# Altium project Magneto.PrjPCB (part 1 of 5)
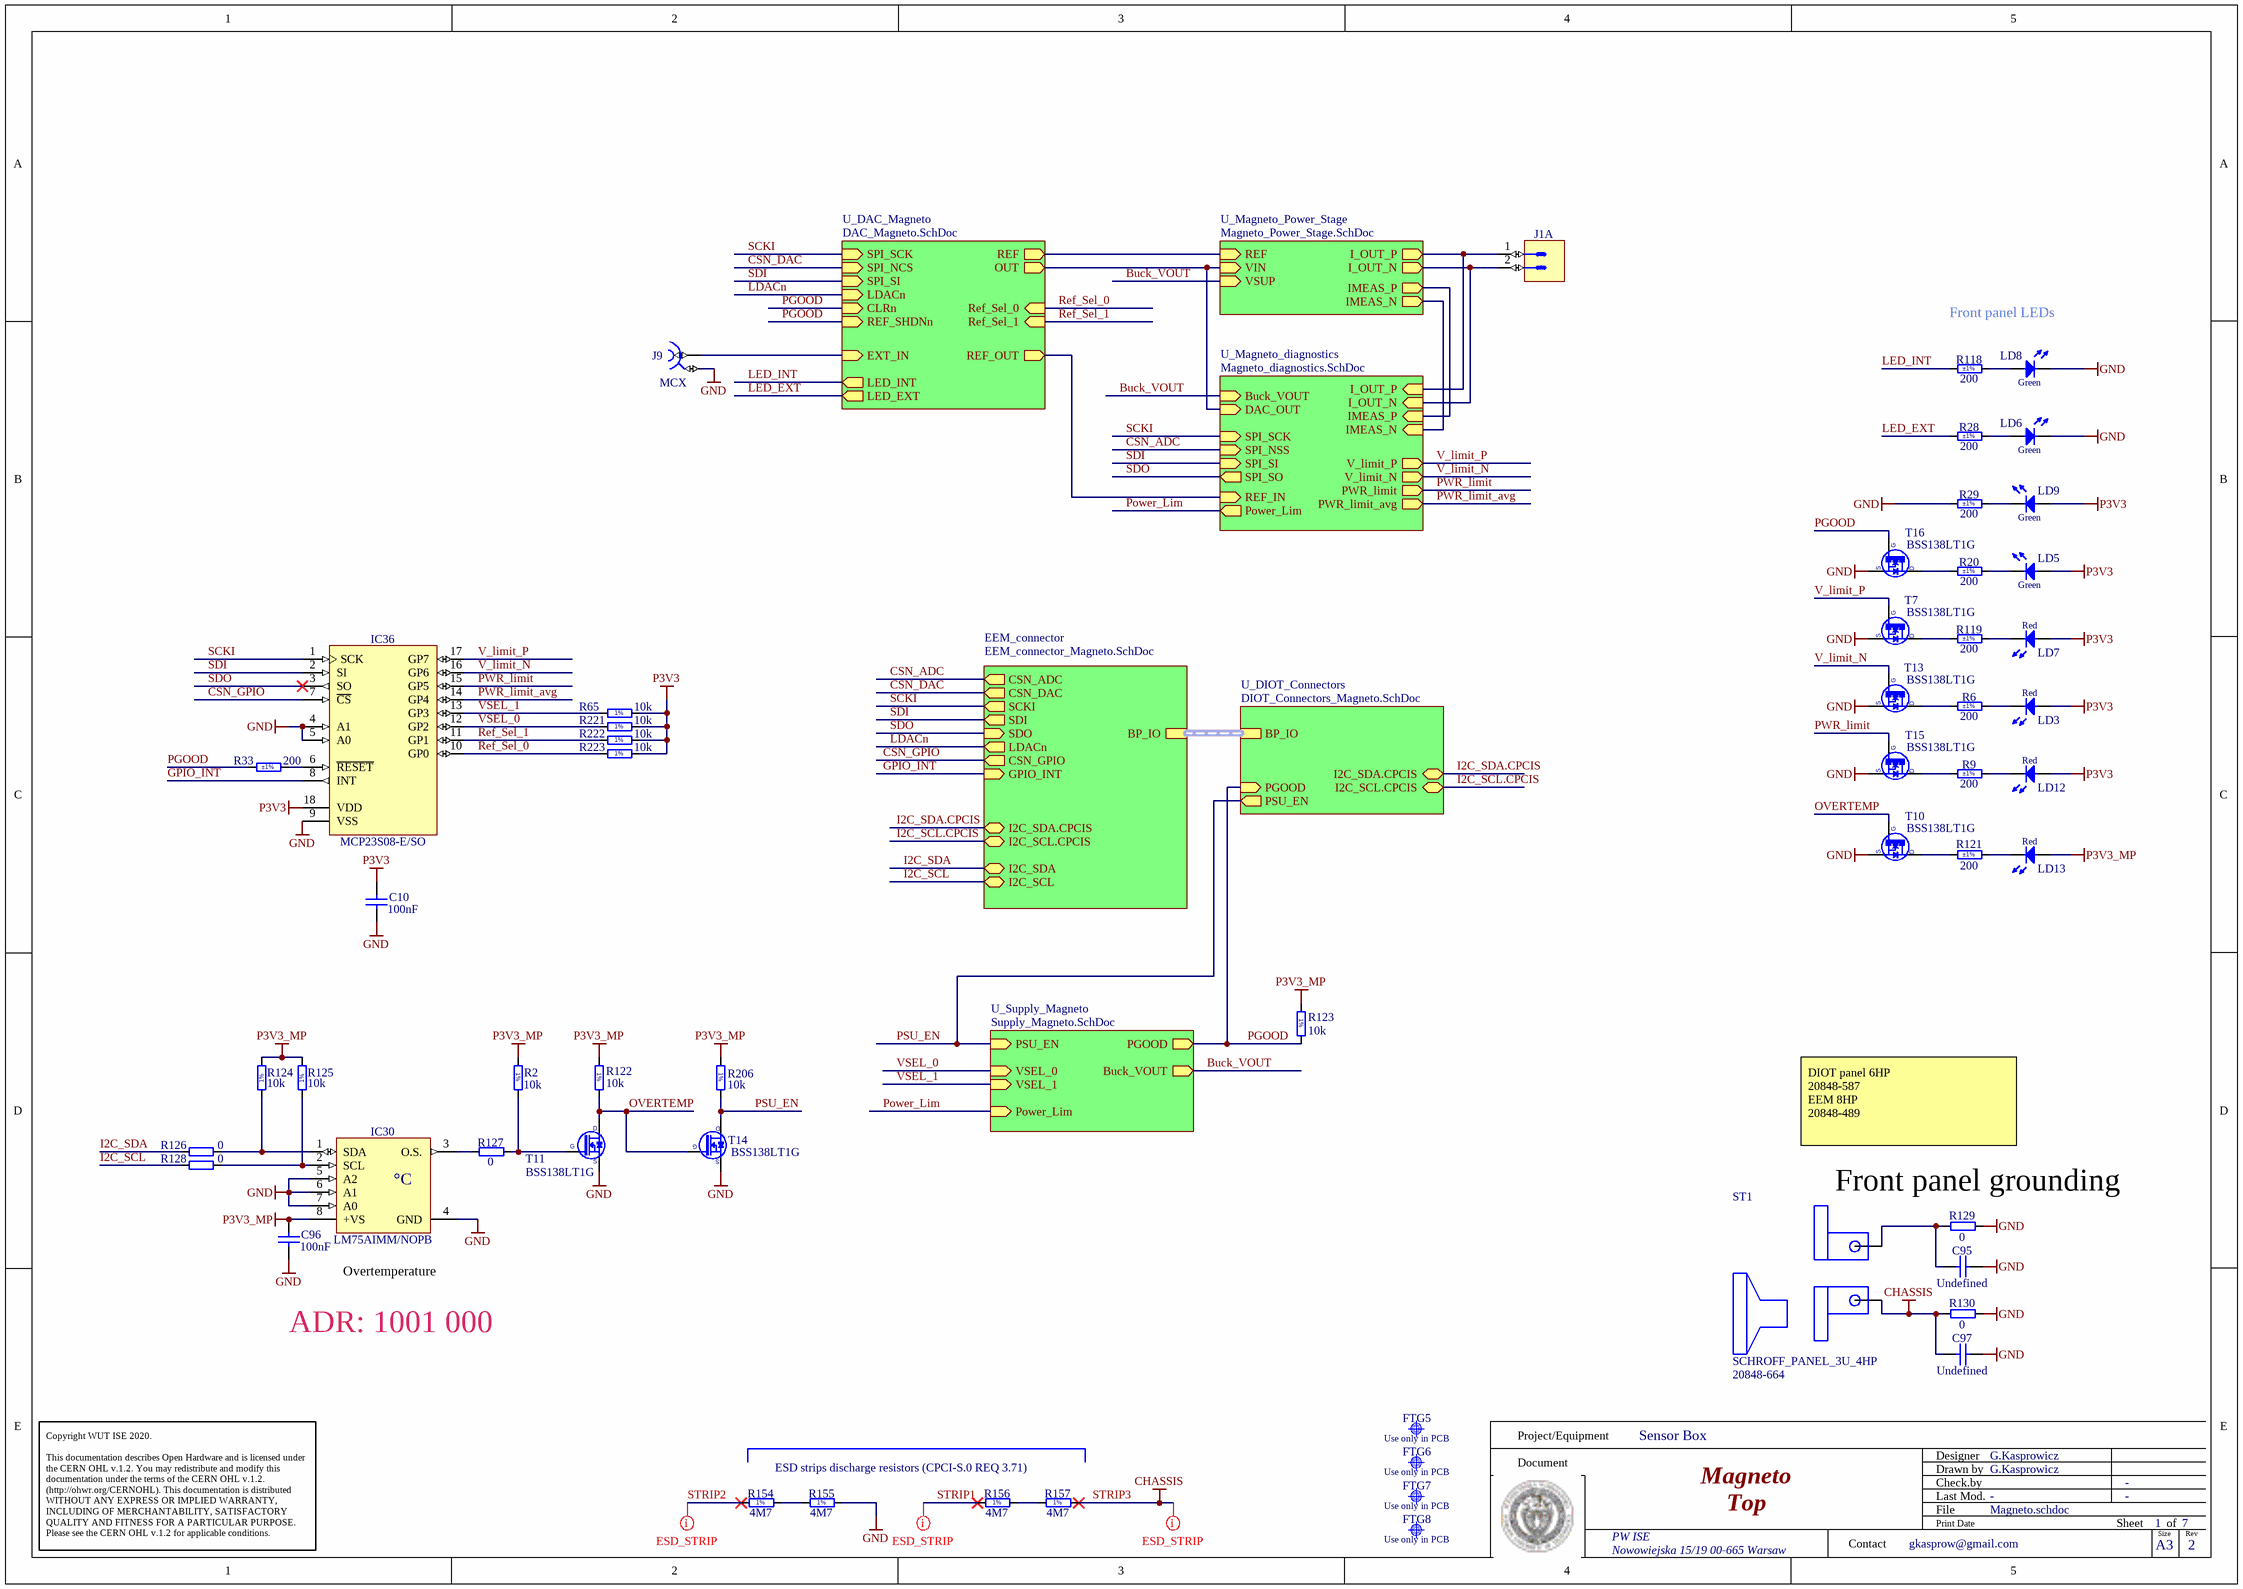
[diagram p0: Magneto.schdoc]
8 sheets, 547 parts. Net scope: hierarchical (ports join the sheet entries above them; power ports are global).
Board file: Magneto.PCBDOC
Sheets:
  Magneto.schdoc
    EEM_connector = EEM_connector_Magneto.SchDoc
    U_DIOT_Connectors = DIOT_Connectors_Magneto.SchDoc
    U_DAC_Magneto = DAC_Magneto.SchDoc
    U_Magneto_Power_Stage = Magneto_Power_Stage.SchDoc
    U_Supply_Magneto = Supply_Magneto.SchDoc
      U_Supply_BuckVout = Supply_BuckVout.SchDoc
    U_Magneto_diagnostics = Magneto_diagnostics.SchDoc

## Sheet Magneto.schdoc: Magneto
size 420 x 297 mm; EDA_Number: ARTIQ; Projet: HVPSU_ISOL; Author: G.Kasprowicz; CompanyName: WUT ISE; DrawnBy: G.Kasprowicz; Organization: WUT ISE; Address1: PW ISE; Address2: Nowowiejska 15/19 00-665 Warsaw; Address3: gkasprow@gmail.com; DocumentNumber: 1; Revision: 2; SheetNumber: 1; SheetTotal: 7; ModifiedBy: -; CheckedDate: -; Title2: Top; DivGrp: WUT ISE; Designer: G.Kasprowicz; ModifiedDate: -; ProjectName: Sensor Box

### Parts
C10  100nF  [CAPC1005X55N]
C95  Undefined  [CAPC2012X135N]
C96  100nF  [CAPC1005X55N]
C97  Undefined  [CAPC2012X135N]
FTG5  Use only in PCB  [FIDUCIAL_TOP_C100-200]  (no BOM)
FTG6  Use only in PCB  [FIDUCIAL_TOP_S100-200]  (no BOM)
FTG7  Use only in PCB  [FIDUCIAL_TOP_S100-200]  (no BOM)
FTG8  Use only in PCB  [FIDUCIAL_TOP_S100-200]  (no BOM)
IC30  LM75AIMM/NOPB  [SOP65P490X109-8N]
IC36  MCP23S08-E/SO  [SOIC127P1030X265-18N]
J1  (no value)  [PHOENIX_1817615]  (part A of 2)
J9  MCX  [AMPHENOL_919-383J-51A]
LD3  Red  [LED_DIALIGHT_555-200]
LD5  Green  [LED_DIALIGHT_555-230]
LD6  Green  [LED_DIALIGHT_555-230]
LD7  Red  [LED_DIALIGHT_555-200]
LD8  Green  [LED_DIALIGHT_555-230]
LD9  Green  [LED_DIALIGHT_555-230]
LD12  Red  [LED_DIALIGHT_555-200]
LD13  Red  [LED_DIALIGHT_555-200]
R2  10k  [RESC1005X40N]
R6  200  Tolerance: ±1%  [RESC1608X55N]
R9  200  Tolerance: ±1%  [RESC1608X55N]
R20  200  Tolerance: ±1%  [RESC1608X55N]
R28  200  Tolerance: ±1%  [RESC1608X55N]
R29  200  Tolerance: ±1%  [RESC1608X55N]
R33  200  Tolerance: ±1%  [RESC1608X55N]
R65  10k  [RESC1005X40N]
R118  200  Tolerance: ±1%  [RESC1608X55N]
R119  200  Tolerance: ±1%  [RESC1608X55N]
R121  200  Tolerance: ±1%  [RESC1608X55N]
R122  10k  [RESC1005X40N]
R123  10k  [RESC1005X40N]
R124  10k  [RESC1005X40N]
R125  10k  [RESC1005X40N]
R126  0  [RESC1005X40N]
R127  0  [RESC1005X40N]
R128  0  [RESC1005X40N]
R129  0  [RESC2012X60N]
R130  0  [RESC2012X60N]
R154  4M7  [RESC2113X55N]
R155  4M7  [RESC2113X55N]
R156  4M7  [RESC2113X55N]
R157  4M7  [RESC2113X55N]
R206  10k  [RESC1005X40N]
R221  10k  [RESC1005X40N]
R222  10k  [RESC1005X40N]
R223  10k  [RESC1005X40N]
ST1  SCHROFF_PANEL_3U_4HP  Manufacturer Part Number 2: 20848-664  [SCHROFF_PANEL_3HP_4U]
T7  BSS138LT1G  [SOT95P240X110-3N]
T10  BSS138LT1G  [SOT95P240X110-3N]
T11  BSS138LT1G  [SOT95P240X110-3N]
T13  BSS138LT1G  [SOT95P240X110-3N]
T14  BSS138LT1G  [SOT95P240X110-3N]
T15  BSS138LT1G  [SOT95P240X110-3N]
T16  BSS138LT1G  [SOT95P240X110-3N]

### Sub-sheets
EEM_connector = EEM_connector_Magneto.SchDoc: BP_IO (harness BP_Conn), I2C_SDA.CPCIS (bidir), I2C_SCL.CPCIS (bidir), I2C_SDA (bidir), I2C_SCL (bidir), CSN_DAC (out), SCKI (out), SDI (out), LDACn (out), SDO (in), CSN_ADC (out), CSN_GPIO (out), GPIO_INT (in)
U_DAC_Magneto = DAC_Magneto.SchDoc: OUT (out), SPI_SCK (in), SPI_NCS (in), SPI_SI (in), CLRn (in), LDACn (in), REF_SHDNn (in), Ref_Sel_0 (in), Ref_Sel_1 (in), REF (out), EXT_IN (in), LED_INT (out), LED_EXT (out), REF_OUT (out)
U_DIOT_Connectors = DIOT_Connectors_Magneto.SchDoc: BP_IO (harness BP_Conn), I2C_SDA.CPCIS (bidir), I2C_SCL.CPCIS (bidir), PSU_EN (out), PGOOD (in)
U_Magneto_diagnostics = Magneto_diagnostics.SchDoc: Buck_VOUT (in), IMEAS_N (in), DAC_OUT (in), V_limit_P (out), V_limit_N (out), PWR_limit (out), SPI_SCK (in), SPI_NSS (in), SPI_SI (in), SPI_SO (out), I_OUT_P (in), I_OUT_N (in), IMEAS_P (in), REF_IN (in), Power_Lim (out), PWR_limit_avg (out)
U_Magneto_Power_Stage = Magneto_Power_Stage.SchDoc: REF (in), VIN (in), VSUP (in), I_OUT_P (out), I_OUT_N (out), IMEAS_P (out), IMEAS_N (out)
U_Supply_Magneto = Supply_Magneto.SchDoc: PSU_EN (in), PGOOD (out), VSEL_0 (in), VSEL_1 (in), Buck_VOUT (out), Power_Lim (in)

### Nets
CHASSIS: C97.1 R130.1 R157.2 ST1.0  [also labelled STRIP3]
GND: C10.1 C95.2 C96.1 C97.2 IC30.4(GND) IC30.5(A2) IC30.6(A1) IC30.7(A0) IC36.4(A1) IC36.5(A0) IC36.9(VSS) J9.2 LD6.1(C) LD8.1(C) R29.2 R129.2 R130.2 R155.2 T7.2(S) T10.2(S) T11.2(S) T13.2(S) T14.2(S) T15.2(S) T16.2(S)
P3V3: C10.2 IC36.18(VDD) LD3.2(A) LD5.2(A) LD7.2(A) LD9.2(A) LD12.2(A) R65.2 R221.2 R222.2 R223.2
P3V3_MP: C96.2 IC30.8(+VS) LD13.2(A) R2.1 R122.1 R123.1 R124.2 R125.2 R206.1
Buck_VOUT: sheet U_Magneto_Power_Stage/VSUP, sheet U_Supply_Magneto/Buck_VOUT, sheet U_Magneto_diagnostics/Buck_VOUT
CSN_ADC: sheet EEM_connector/CSN_ADC, sheet U_Magneto_diagnostics/SPI_NSS
CSN_DAC: sheet EEM_connector/CSN_DAC, sheet U_DAC_Magneto/SPI_NCS
CSN_GPIO: IC36.7(~{CS}) ; sheet EEM_connector/CSN_GPIO
DAC_OUT: sheet U_DAC_Magneto/OUT, sheet U_Magneto_Power_Stage/VIN, sheet U_Magneto_diagnostics/DAC_OUT
EXT_IN: J9.1 ; sheet U_DAC_Magneto/EXT_IN
GPIO_INT: IC36.8(INT) ; sheet EEM_connector/GPIO_INT
I2C_SCL: R128.1 ; sheet EEM_connector/I2C_SCL
I2C_SCL.CPCIS: sheet EEM_connector/I2C_SCL.CPCIS, sheet U_DIOT_Connectors/I2C_SCL.CPCIS
I2C_SDA: R126.1 ; sheet EEM_connector/I2C_SDA
I2C_SDA.CPCIS: sheet EEM_connector/I2C_SDA.CPCIS, sheet U_DIOT_Connectors/I2C_SDA.CPCIS
I_OUT_N: J1.2 ; sheet U_Magneto_Power_Stage/I_OUT_N, sheet U_Magneto_diagnostics/I_OUT_N
I_OUT_P: J1.1 ; sheet U_Magneto_Power_Stage/I_OUT_P, sheet U_Magneto_diagnostics/I_OUT_P
IMEAS_N: sheet U_Magneto_Power_Stage/IMEAS_N, sheet U_Magneto_diagnostics/IMEAS_N
IMEAS_P: sheet U_Magneto_Power_Stage/IMEAS_P, sheet U_Magneto_diagnostics/IMEAS_P
LDACn: sheet EEM_connector/LDACn, sheet U_DAC_Magneto/LDACn
LED_EXT: R28.1 ; sheet U_DAC_Magneto/LED_EXT
LED_INT: R118.1 ; sheet U_DAC_Magneto/LED_INT
OVERTEMP: R122.2 T10.1(G) T11.3(D) T14.1(G)
PGOOD: R33.1 R123.2 T16.1(G) ; sheet U_DIOT_Connectors/PGOOD, sheet U_DAC_Magneto/CLRn, sheet U_DAC_Magneto/REF_SHDNn, sheet U_Supply_Magneto/PGOOD
Power_Lim: sheet U_Supply_Magneto/Power_Lim, sheet U_Magneto_diagnostics/Power_Lim
PSU_EN: R206.2 T14.3(D) ; sheet U_DIOT_Connectors/PSU_EN, sheet U_Supply_Magneto/PSU_EN
PWR_limit: IC36.15(GP5) T15.1(G) ; sheet U_Magneto_diagnostics/PWR_limit
PWR_limit_avg: IC36.14(GP4) ; sheet U_Magneto_diagnostics/PWR_limit_avg
REF: sheet U_DAC_Magneto/REF, sheet U_Magneto_Power_Stage/REF
REF_IN: sheet U_DAC_Magneto/REF_OUT, sheet U_Magneto_diagnostics/REF_IN
Ref_Sel_0: IC36.10(GP0) R223.1 ; sheet U_DAC_Magneto/Ref_Sel_0
Ref_Sel_1: IC36.11(GP1) R222.1 ; sheet U_DAC_Magneto/Ref_Sel_1
SCKI: IC36.1(SCK) ; sheet EEM_connector/SCKI, sheet U_DAC_Magneto/SPI_SCK, sheet U_Magneto_diagnostics/SPI_SCK
SDI: IC36.2(SI) ; sheet EEM_connector/SDI, sheet U_DAC_Magneto/SPI_SI, sheet U_Magneto_diagnostics/SPI_SI
SDO: IC36.3(SO) ; sheet EEM_connector/SDO, sheet U_Magneto_diagnostics/SPI_SO
STRIP1: R156.1
STRIP2: R154.1
V_limit_N: IC36.16(GP6) T13.1(G) ; sheet U_Magneto_diagnostics/V_limit_N
V_limit_P: IC36.17(GP7) T7.1(G) ; sheet U_Magneto_diagnostics/V_limit_P
VSEL_0: IC36.12(GP2) R221.1 ; sheet U_Supply_Magneto/VSEL_0
VSEL_1: IC36.13(GP3) R65.1 ; sheet U_Supply_Magneto/VSEL_1
NetC95_1: C95.1 R129.1 ST1.1
NetIC30_1: IC30.1(SDA) R124.1 R126.2
NetIC30_2: IC30.2(SCL) R125.1 R128.2
NetIC30_3: IC30.3(O.S.) R127.1
NetIC36_6: IC36.6(~{RESET}) R33.2
NetLD3_1: LD3.1(C) R6.2
NetLD5_1: LD5.1(C) R20.1
NetLD6_2: LD6.2(A) R28.2
NetLD7_1: LD7.1(C) R119.2
NetLD8_2: LD8.2(A) R118.2
NetLD9_1: LD9.1(C) R29.1
NetLD12_1: LD12.1(C) R9.2
NetLD13_1: LD13.1(C) R121.2
NetR2_2: R2.2 R127.2 T11.1(G)
NetR6_1: R6.1 T13.3(D)
NetR9_1: R9.1 T15.3(D)
NetR20_2: R20.2 T16.3(D)
NetR119_1: R119.1 T7.3(D)
NetR121_1: R121.1 T10.3(D)
NetR154_2: R154.2 R155.1
NetR156_2: R156.2 R157.1

### Buses and harness runs
harness sheet EEM_connector/BP_IO = sheet U_DIOT_Connectors/BP_IO

### Layout directives
net class ESD_STRIP: CHASSIS, STRIP1, STRIP2

### Notes on the sheet
- Front panel LEDs
- DIOT panel 6HP
  20848-587
  EEM 8HP
  20848-489
- (near R129) Front panel grounding
- ADR: 1001 000
- Overtemperature
- ESD strips discharge resistors (CPCI-S.0 REQ 3.71)
- Project/Equipment
- Document
- Designer
- Drawn by
- Check.by
- Copyright WUT ISE 2020.
  This documentation describes Open Hardware and is licensed under the CERN OHL v.1.2. You may redistribute and modify this documentation under the terms of the CERN OHL v.1.2. (http://ohwr.org/CERNOHL). This documentation is distributed WITHOUT ANY EXPRESS OR IMPLIED WARRANTY, INCLUDING OF MERCHANTABILITY, SATISFACTORY QUALITY AND FITNESS FOR A PARTICULAR PURPOSE. Please see the CERN OHL v.1.2 for applicable conditions.
- Contact
- File
- Last Mod.
- Print Date
- Sheet
- Size
- A3
- of
- Rev
- (in symbol LM75AIMM/NOPB) °C
- (in symbol R0402_10K_1%_0.0625W_100PPM) 1%
- (in symbol R0805_4M7_1%_0.125W_100PPM_VISHAY_CRCW e3) 1%

### Library data of the parts
C10 C96 = CC0402_100NF_16V_10%_X5R: Non-polarised capacitor; Part Description: SMD Multilayer Chip Ceramic Capacitor; Manufacturer: GENERIC; Manufacturer1 Part Number: GRM155R61C104KA88D; Voltage: 16V; TC: X5R; Tolerance: ±10%; Part Number: CC0402_100NF_16V_10%_X5R; Component Kind: Standard; Component Type: Standard; Pin Count: 2; Value: 100nF; Status: None; Manufacturer Part Number: CC0402_100NF_16V_10%_X5R; Case: 0402; Mounted: Yes; Socket: No; SMD: Yes; Sense: No; Manufacturer1 Example: MURATA; Manufacturer1 ComponentHeight: 0.55mm; HelpURL: \\cern.ch\dfs\Applications\Altium\Datasheets\CC0402_X5R_MURATA_GRM.pdf; Author: CERN DEM JLC; CreateDate: 10.12.2013; LatestRevisionDate: 10.12.2013
C95 C97 = CC0805_NO-VALUE: Non-polarised capacitor; Part Description: Reserved Footprint For 0805(2012) Chip Ceramic Capacitor; Mounted: No; Part Number: CC0805_NO-VALUE; Component Kind: Standard; Component Type: Standard; Pin Count: 2; Value: Undefined; Status: None; Manufacturer: Undefined; Manufacturer Part Number: CC0805_NO-VALUE; Case: 0805; Socket: No; SMD: Yes; Sense: No; Manufacturer1 ComponentHeight: 1.35mm; HelpURL: Undefined; Author: CERN DEM JLC; CreateDate: 10.12.2008; LatestRevisionDate: 11.09.2013
FTG5 = FIDUCIAL_TARGET_C100-200: Fiducial Target; Part Description: Round Fiducial Target, Top Layer, 1.0mm, Top Solder 2.0mm, Keepout =2.0mm; Mounted: No; Part Number: FIDUCIAL_TARGET_C100-200; Component Type: Standard (No BOM); Pin Count: 1; Family: Fiducial; Socket: No; SMD: Yes; Sense: No; Status: None; ComponentHeight: 0mm; HelpURL: Undefined; Author: CERN DEM JLC; CreateDate: 09.02.2010; LatestRevisionDate: 04.04.2012; PackageDescription: Round Fiducial Target, Top Layer, 1.0mm, Top Solder 2.0mm, Keepout =2.0mm
FTG6-FTG8 = FIDUCIAL_TARGET_S100-200: Fiducial Target; Part Description: Square Fiducial Target, Top Layer, 1.0mm, Top Solder 2.0mm, Keepout =2.0mm; Mounted: No; Part Number: FIDUCIAL_TARGET_S100-200; Component Type: Standard (No BOM); Pin Count: 1; Family: Fiducial; Socket: No; SMD: Yes; Sense: No; Status: None; ComponentHeight: 0mm; HelpURL: Undefined; Author: CERN DEM JLC; CreateDate: 09.02.2010; LatestRevisionDate: 04.04.2012; PackageDescription: Square Fiducial Target, Top Layer, 1.0mm, Top Solder 2.0mm, Keepout =2.0mm
IC30 = LM75AIMM/NOPB: Digital Temperature Sensor and Thermal Watchdog with Two-Wire Interface; Manufacturer1: TEXAS INSTRUMENTS; jcIC31: -25° to +100°C ±2°C Digital Temperature Sensor and Thermal Watchdog with Two-Wire Interface; PressFit: No; Bonding: No; Part Number: LM75AIMM/NOPB; Component Kind: Standard; Component Type: Standard; Device: LM75AIMM/NOPB; PackageDescription: SOP, 0.65mm pitch; 8 pin,3.00mm W X 3.00mm L X 1.09mm H bodyI, PC Medium Density; Manufacturer1 Part Number: LM75AIMM/NOPB; Pin Count: 8; Case: SSOP8; Mounted: Yes; Socket: No; SMD: Yes; Sense: No; ComponentHeight: 1.09mm; HelpURL: \\cern.ch\dfs\Applications\Altium\Datasheets\LM75AIMM-NOPB.pdf; Author: CERN DEM JLC; CreateDate: 15.10.2012; LatestRevisionDate: 15.10.2012
IC36 = MCP23S08-E/SO: 8-Bit I/O Expander with Serial Interface SPI; Manufacturer1: MICROCHIP TECHNOLOGY; PressFit: No; Bonding: No; Part Number: MCP23S08-E/SO; Component Kind: Standard; Component Type: Standard; Device: MCP23S08-E/SO; PackageDescription: SOIC, 18-Leads, Body 13.9x7.6mm (max), Pitch 1.27mm, IPC Medium Density; Part Description: 8-Bit I/O Expander with Serial Interface SPI; Manufacturer1 Part Number: MCP23S08-E/SO; Pin Count: 18; Case: SOIC18; Mounted: Yes; Socket: No; SMD: Yes; Sense: No; ComponentHeight: 2.65mm; Author: CERN DEM HF; HelpURL: \\cern.ch\dfs\Applications\Altium\Datasheets\MCP23008-MCP23S08.pdf; CreateDate: 25.11.2022; LatestRevisionDate: 25.11.2022
J1 = PHOENIX_1817615: Connector 2 Male+2MTG; Part Number: 1817615 (MC 1,5/ 2-GF-3,5-LR); Part Description: 8A 160V, 2 Position PCB Terminal Block, Pitch 3.5mm, Lock & Release Threaded Flange (Conductor/PCB connection direction: 90°); Manufacturer1: PHOENIX CONTACT; PressFit: No; Component Kind: Standard; Component Type: Standard; Pin Count: 2; Mounted: Yes; Socket: No; SMD: No; Sense: No; Status: None; Manufacturer1 Part Number: 1817615; ComponentHeight: 7.25mm; HelpURL: \\cern.ch\dfs\Applications\Altium\Datasheets\PHOENIX_1817615.pdf; Author: CERN DEM BC; CreateDate: 04.06.2021; LatestRevisionDate: 04.06.2021
J9 = AMPHENOL_919-383J-51A: Part Description: 50 Ohm, RF Connector, MCX Right Angle PCB Receptacle Jack; PressFit: No; Part Number: AMPHENOL_919-383J-51A; Component Kind: Standard; Component Type: Standard; Pin Count: 5; Family: MCX; Mounted: Yes; Socket: No; SMD: No; Sense: No; Status: None; Manufacturer1: AMPHENOL; Manufacturer1 Part Number: 919-383J-51A; ComponentHeight: 6mm; HelpURL: \\cern.ch\dfs\Applications\Altium\Datasheets\AMPHENOL_919-383J-51A.pdf; Author: CERN DEM BC; CreateDate: 31.01.2019; LatestRevisionDate: 31.01.2019
LD3 LD7 LD12 LD13 = LED_DIALIGHT_555-2001F: LED Red 1C 2A; Part Description: Single 2mm Red LED CBI® Circuit Board Indicator; PressFit: No; Bonding: No; Part Number: LED_DIALIGHT_555-2001F; Component Kind: Standard; Component Type: Standard; Color: Red; PackageDescription: Single 2mm Red LED, Body 5.08x2.54mm, Pin spacing 2.54mm; Manufacturer1: DIALIGHT; Manufacturer1 Part Number: 555-2001F; Pin Count: 2; Mounted: Yes; Socket: No; SMD: No; Sense: No; ComponentHeight: 6.35mm; HelpURL: \\cern.ch\dfs\Applications\Altium\Datasheets\LED_DIALIGHT_555-2001F.pdf; Author: CERN DEM JMW; CreateDate: 22.09.2008; LatestRevisionDate: 17.03.2010
LD5 LD6 LD8 LD9 = LED_DIALIGHT_555-2301F: LED Green 1C 2A; Part Description: Single 2mm Green LED CBI® Circuit Board Indicator; PressFit: No; Bonding: No; Part Number: LED_DIALIGHT_555-2301F; Component Kind: Standard; Component Type: Standard; Color: Green; PackageDescription: Single 2mm Green LED, Body 5.08x2.54mm, Pin spacing 2.54mm; Manufacturer1: DIALIGHT; Manufacturer1 Part Number: 555-2301F; Pin Count: 2; Mounted: Yes; Socket: No; SMD: No; Sense: No; ComponentHeight: 6.35mm; HelpURL: \\cern.ch\dfs\Applications\Altium\Datasheets\LED_DIALIGHT_555-2301F.pdf; Author: CERN DEM JMW; CreateDate: 22.09.2008; LatestRevisionDate: 17.03.2010
R2 R65 R122-R125 R206 R221-R223 = R0402_10K_1%_0.0625W_100PPM: Resistor - 1%; Part Description: General Purpose Thick Film Chip Resistor; Manufacturer: GENERIC; Manufacturer1: Vishay; Manufacturer1 Part Number: RCA040210K0FKED; TC: ±100ppm/°C; PressFit: No; Part Number: R0402_10K_1%_0.0625W_100PPM; Component Kind: Standard; Component Type: Standard; Pin Count: 2; Value: 10k; Status: Not Recommended; Power: 0.0625W; Tolerance: ±1%; Manufacturer Part Number: R0402_10K_1%_0.0625W_100PPM; Case: 0402; Mounted: Yes; Sense: No; Socket: No; SMD: Yes; Manufacturer1 ComponentHeight: 0.4mm; HelpURL: \\cern.ch\dfs\Applications\Altium\Datasheets\R0402_Phycomp_RC0402.pdf; Author: CERN DEM JLC; CreateDate: 03.12.2007; LatestRevisionDate: 17.10.2012
R6 R9 R20 R28 R29 R33 R118 R119 R121 = R0603_200R_1%_0.1W_100PPM: Resistor - 1%; Part Description: General Purpose Thick Film Chip Resistor; Manufacturer: GENERIC; Manufacturer1: Vishay; Manufacturer1 Part Number: CRCW0603200RFKEA; Power: 0.1W; TC: ±100ppm/°C; PressFit: No; Part Number: R0603_200R_1%_0.1W_100PPM; Component Kind: Standard; Component Type: Standard; Pin Count: 2; Value: 200; Status: Preferred; Manufacturer Part Number: R0603_200R_1%_0.1W_100PPM; Case: 0603; Mounted: Yes; Sense: No; Socket: No; SMD: Yes; Manufacturer1 ComponentHeight: 0.55mm; HelpURL: \\cern.ch\dfs\Applications\Altium\Datasheets\R0603_NIC_NRC.pdf; Author: CERN DEM JLC; CreateDate: 03.12.2007; LatestRevisionDate: 13.03.2008
R126-R128 = R0402_0R_JUMPER: Resistor; Part Description: 1A (0.05R Max DC Resistance) Zero Ohm Jumper; Manufacturer: GENERIC; Manufacturer1: Vishay; Manufacturer1 Part Number: CRCW04020000Z0EDC; Part Number: R0402_0R_JUMPER; Component Kind: Standard; Component Type: Standard; Pin Count: 2; Value: 0; Status: Not recommended; Manufacturer Part Number: R0402_0R_JUMPER; Case: 0402; Mounted: Yes; Sense: No; Socket: No; SMD: Yes; Manufacturer1 ComponentHeight: 0.4mm; HelpURL: \\cern.ch\dfs\Applications\Altium\Datasheets\R0402_Phycomp_RC0402.pdf; Author: CERN DEM JLC; CreateDate: 03.12.2007; LatestRevisionDate: 17.10.2012
R129 R130 = R0805_0R_JUMPER: Resistor; Part Description: 2A (0.05R Max DC Resistance) Zero Ohm Jumper; Manufacturer: GENERIC; Manufacturer1: Vishay; Manufacturer1 Part Number: RCA08050000ZSEA; PressFit: No; Part Number: R0805_0R_JUMPER; Component Kind: Standard; Component Type: Standard; Pin Count: 2; Value: 0; Status: Preferred; Manufacturer Part Number: R0805_0R_JUMPER; Case: 0805; Mounted: Yes; Sense: No; Socket: No; SMD: Yes; Manufacturer1 ComponentHeight: 0.6mm; HelpURL: \\cern.ch\dfs\Applications\Altium\Datasheets\R0805_NIC_NRC.pdf; Author: CERN DEM JLC; CreateDate: 03.12.2007; LatestRevisionDate: 13.03.2008
R154-R157 = R0805_4M7_1%_0.125W_100PPM_VISHAY_CRCW e3: Resistor - 1%; Part Description: 150V, Standard Thick Film Chip Resistor; Manufacturer1: VISHAY; Manufacturer1 Part Number: CRCW08054M70FKEA; Power: 0.125W; TC: ±100ppm/°C; PressFit: No; Part Number: R0805_4M7_1%_0.125W_100PPM_VISHAY_CRCW e3; Component Kind: Standard; Component Type: Standard; Pin Count: 2; Value: 4M7; Status: None; Tolerance: ±1%; Case: 0805; Mounted: Yes; Sense: No; Socket: No; SMD: Yes; ComponentHeight: 0.5mm; HelpURL: \\cern.ch\dfs\Applications\Altium\Datasheets\R0805_VISHAY_CRCW e3.pdf; Author: CERN DEM BR; CreateDate: 27/05/2019; LatestRevisionDate: 27/05/2019
ST1 = SCHROFF_PANEL_3U_4HP: Schroff 3HP 4U EUROCARD Panel Kit; Manufacturer1 Part Number: 20818-017; Manufacturer1: Schroff; Part Number: 20818-017
T7 T10 T11 T13-T16 = BSS138LT1G: N-CHANNEL MOSFET WITH DIODE; Part Description: 50V 200mA N-Channel Enhancement Mode Field-Effect Transistor; Manufacturer1: ON SEMICONDUCTOR; PressFit: No; Bonding: No; Part Number: BSS138LT1G; Component Kind: Standard; Component Type: Standard; Device: BSS138LT1G; PackageDescription: SOT23 3-Leads, Pitch 0.95mm - Body 1.4x3mm, IPC Medium Density; Manufacturer1 Part Number: BSS138LT1G; Pin Count: 3; Case: SOT23-3; Mounted: Yes; Socket: No; SMD: Yes; Sense: No; ComponentHeight: 1.11mm; HelpURL: \\cern.ch\dfs\Applications\Altium\Datasheets\BSS138LT1G.pdf; Author: CERN DEM JLC; CreateDate: 23.03.2009; LatestRevisionDate: 23.03.2009

## Sheet EEM_connector_Magneto.SchDoc: EEM connector
size 420 x 297 mm; Author: G.Kasprowicz; CompanyName: WUT ISE; DrawnBy: G.Kasprowicz; Organization: WUT ISE; Address1: PW ISE; Address2: Nowowiejska 15/19 00-665 Warsaw; Address3: gkasprow@gmail.com; DocumentNumber: 3; Revision: 2; SheetNumber: 3; SheetTotal: 7; ModifiedBy: -; CheckedDate: -; Title2: & LVDS circuit; DivGrp: WUT ISE; Designer: G.Kasprowicz; ModifiedDate: -; ProjectName: Sensor Box
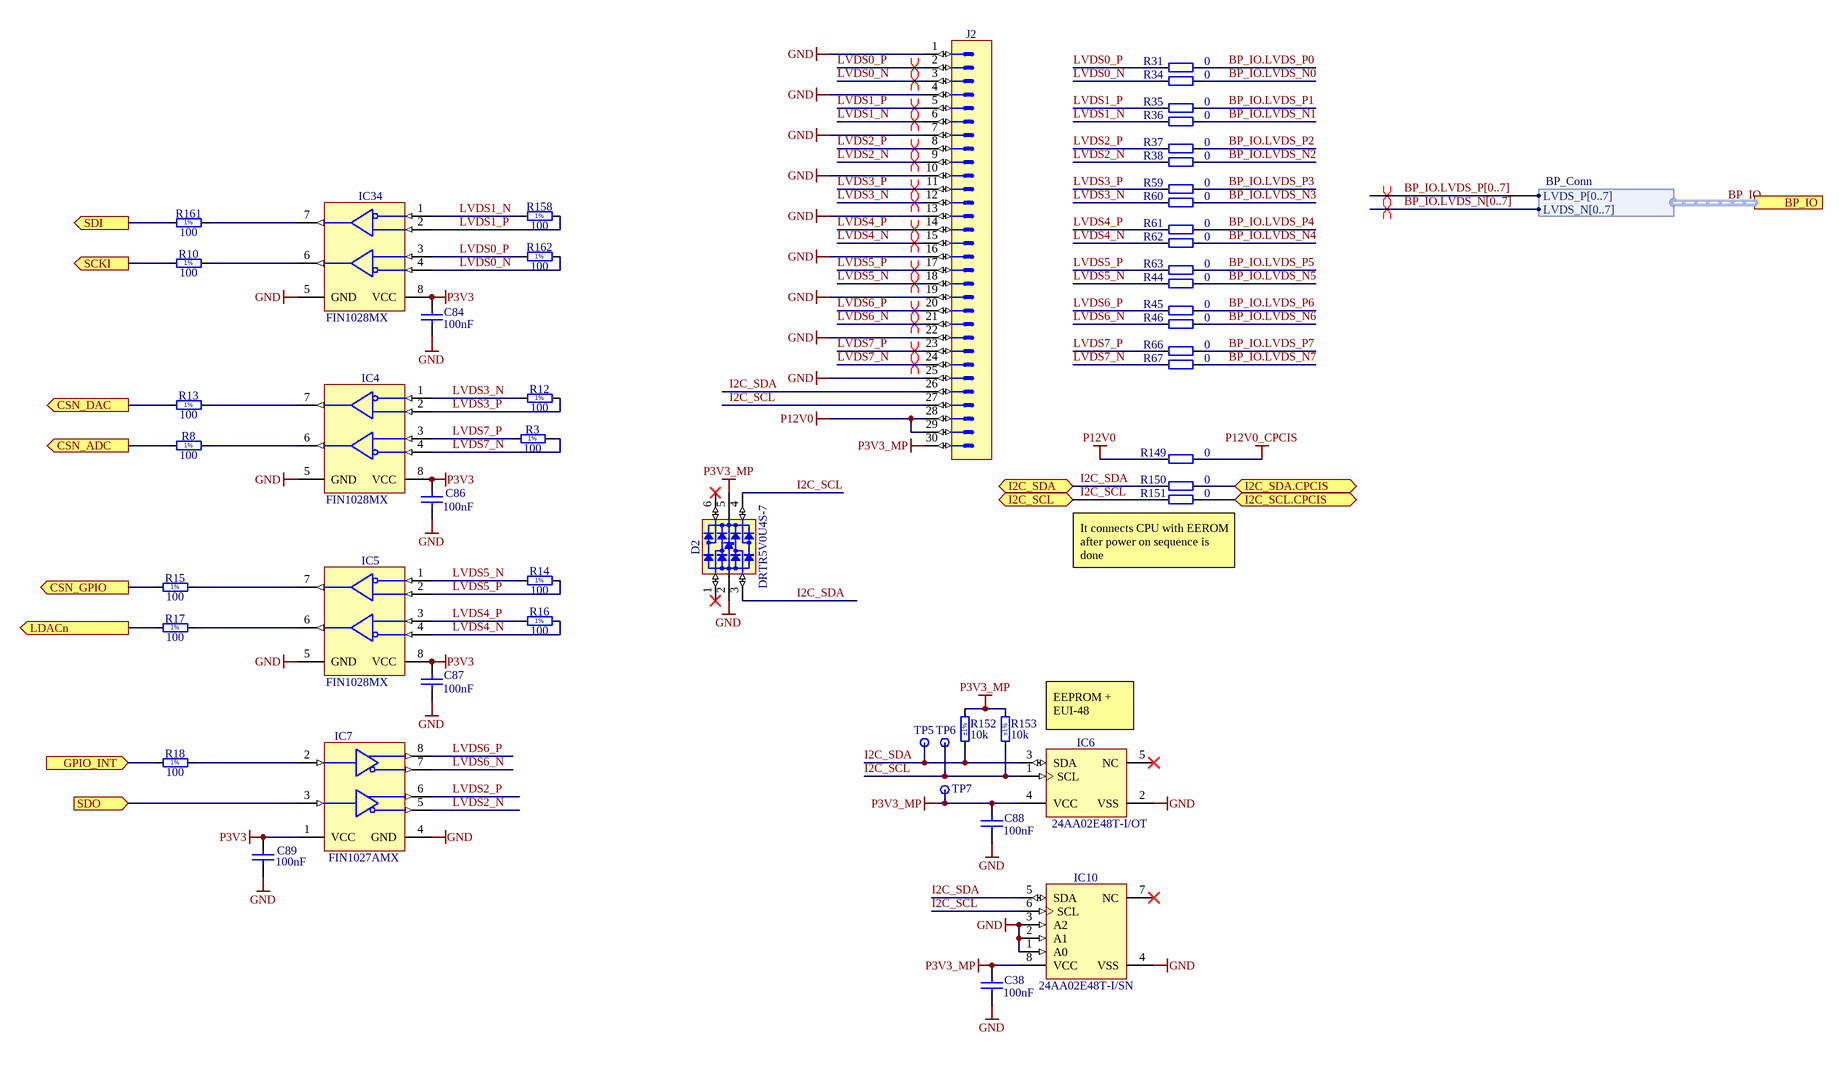
[diagram p1: EEM_connector_Magneto.SchDoc]

### Parts
C38  100nF  [CAPC1005X55N]
C84  100nF  [CAPC1005X55N]
C86  100nF  [CAPC1005X55N]
C87  100nF  [CAPC1005X55N]
C88  100nF  [CAPC1005X55N]
C89  100nF  [CAPC1005X55N]
D2  DRTR5V0U4S-7  [SOT65P210X110-6N]
IC4  FIN1028MX  [SOIC127P600X175-8N]
IC5  FIN1028MX  [SOIC127P600X175-8N]
IC6  24AA02E48T-I/OT  [SOT95P280X145-5N]
IC7  FIN1027AMX  [SOIC127P600X175-8N]
IC10  24AA02E48T-I/SN  [SOIC127P600X175-8N]
IC34  FIN1028MX  [SOIC127P600X175-8N]
J2  IDC  [3M_N2530-6002RB]  (value not drawn)
R3  100  [RESC1005X40N]
R8  100  [RESC1005X40N]
R10  100  [RESC1005X40N]
R12  100  [RESC1005X40N]
R13  100  [RESC1005X40N]
R14  100  [RESC1005X40N]
R15  100  [RESC1005X40N]
R16  100  [RESC1005X40N]
R17  100  [RESC1005X40N]
R18  100  [RESC1005X40N]
R31  0  [RESC1005X40N]
R34  0  [RESC1005X40N]
R35  0  [RESC1005X40N]
R36  0  [RESC1005X40N]
R37  0  [RESC1005X40N]
R38  0  [RESC1005X40N]
R44  0  [RESC1005X40N]
R45  0  [RESC1005X40N]
R46  0  [RESC1005X40N]
R59  0  [RESC1005X40N]
R60  0  [RESC1005X40N]
R61  0  [RESC1005X40N]
R62  0  [RESC1005X40N]
R63  0  [RESC1005X40N]
R66  0  [RESC1005X40N]
R67  0  [RESC1005X40N]
R149  0  [RESC2012X60N]
R150  0  [RESC1005X40N]
R151  0  [RESC1005X40N]
R152  10k  Tolerance: ±1%  [RESC1005X40N]
R153  10k  Tolerance: ±1%  [RESC1005X40N]
R158  100  [RESC1005X40N]
R161  100  [RESC1005X40N]
R162  100  [RESC1005X40N]
TP5  Test Point  [TPS127]  (value not drawn)  (no BOM)
TP6  Test Point  [TPS127]  (value not drawn)  (no BOM)
TP7  Test Point  [TPS127]  (value not drawn)  (no BOM)

### Ports
BP_IO (harness BP_Conn), CSN_ADC (out), CSN_DAC (out), CSN_GPIO (out), GPIO_INT (in), I2C_SCL (bidir), I2C_SCL.CPCIS (bidir), I2C_SDA (bidir), I2C_SDA.CPCIS (bidir), LDACn (out), SCKI (out), SDI (out), SDO (in)

### Harnesses
BP_Conn: LVDS_P[0..7], LVDS_N[0..7]

### Nets
GND: C38.1 C84.1 C86.1 C87.1 C88.1 C89.1 D2.2(GND) IC4.5(GND) IC5.5(GND) IC6.2(VSS) IC7.4(GND) IC10.1(A0) IC10.2(A1) IC10.3(A2) IC10.4(VSS) IC34.5(GND) J2.1 J2.4 J2.7 J2.10 J2.13 J2.16 J2.19 J2.22 J2.25
P3V3: C84.2 C86.2 C87.2 C89.2 IC4.8(VCC) IC5.8(VCC) IC7.1(VCC) IC34.8(VCC)
P3V3_MP: C38.2 C88.2 D2.5(VBUS) IC6.4(VCC) IC10.8(VCC) J2.30 R152.2 R153.2 TP7.1
P12V0: J2.28 J2.29 R149.1
P12V0_CPCIS: R149.2
BP_IO.LVDS_N0: R34.2
BP_IO.LVDS_N1: R36.2
BP_IO.LVDS_N2: R38.2
BP_IO.LVDS_N3: R60.2
BP_IO.LVDS_N4: R62.2
BP_IO.LVDS_N5: R44.2
BP_IO.LVDS_N6: R46.2
BP_IO.LVDS_N7: R67.2
BP_IO.LVDS_P0: R31.2
BP_IO.LVDS_P1: R35.2
BP_IO.LVDS_P2: R37.2
BP_IO.LVDS_P3: R59.2
BP_IO.LVDS_P4: R61.2
BP_IO.LVDS_P5: R63.2
BP_IO.LVDS_P6: R45.2
BP_IO.LVDS_P7: R66.2
CSN_ADC: R8.1 ; port CSN_ADC
CSN_DAC: R13.1 ; port CSN_DAC
CSN_GPIO: R15.1 ; port CSN_GPIO
GPIO_INT: R18.1 ; port GPIO_INT
I2C_SCL: D2.4(I/O3) IC6.1(SCL) IC10.6(SCL) J2.27 R151.1 R153.1 TP6.1 ; port I2C_SCL
I2C_SCL.CPCIS: R151.2 ; port I2C_SCL.CPCIS
I2C_SDA: D2.3(I/O2) IC6.3(SDA) IC10.5(SDA) J2.26 R150.1 R152.1 TP5.1 ; port I2C_SDA
I2C_SDA.CPCIS: R150.2 ; port I2C_SDA.CPCIS
LDACn: R17.1 ; port LDACn
LVDS0_N: IC34.4(RIN2-) J2.3 R34.1 R162.2
LVDS0_P: IC34.3(RIN2+) J2.2 R31.1 R162.1
LVDS1_N: IC34.1(RIN1-) J2.6 R36.1 R158.1
LVDS1_P: IC34.2(RIN1+) J2.5 R35.1 R158.2
LVDS2_N: IC7.5(DOUT-) J2.9 R38.1
LVDS2_P: IC7.6(DOUT+) J2.8 R37.1
LVDS3_N: IC4.1(RIN1-) J2.12 R12.1 R60.1
LVDS3_P: IC4.2(RIN1+) J2.11 R12.2 R59.1
LVDS4_N: IC5.4(RIN2-) J2.15 R16.2 R62.1
LVDS4_P: IC5.3(RIN2+) J2.14 R16.1 R61.1
LVDS5_N: IC5.1(RIN1-) J2.18 R14.1 R44.1
LVDS5_P: IC5.2(RIN1+) J2.17 R14.2 R63.1
LVDS6_N: IC7.7(DOUT-) J2.21 R46.1
LVDS6_P: IC7.8(DOUT+) J2.20 R45.1
LVDS7_N: IC4.4(RIN2-) J2.24 R3.2 R67.1
LVDS7_P: IC4.3(RIN2+) J2.23 R3.1 R66.1
SCKI: R10.1 ; port SCKI
SDI: R161.1 ; port SDI
SDO: IC7.3(DIN2RIN-) ; port SDO
NetIC4_6: IC4.6(ROUT2) R8.2
NetIC4_7: IC4.7(ROUT1) R13.2
NetIC5_6: IC5.6(ROUT2) R17.2
NetIC5_7: IC5.7(ROUT1) R15.2
NetIC7_2: IC7.2(DIN1) R18.2
NetIC34_6: IC34.6(ROUT2) R10.2
NetIC34_7: IC34.7(ROUT1) R161.2

Not connected (* = marked no-connect by the designer): D2 1(I/O1)* 6(I/O4)*; IC6 5(NC)*; IC10 7(NC)*

### Buses and harness runs
bus BP_IO.LVDS_N[0..7]
bus BP_IO.LVDS_P[0..7]
harness BP_IO = port BP_IO

### Layout directives
differential pair: (no net found under the mark), LVDS0_N, LVDS0_P, LVDS1_N, LVDS1_P, LVDS2_N, LVDS2_P, LVDS3_N, LVDS3_P, LVDS4_N, LVDS4_P, LVDS5_N, LVDS5_P, LVDS6_N, LVDS6_P, LVDS7_N, LVDS7_P

### Notes on the sheet
- (near R151) It connects CPU with EEROM after power on sequence is done
- EEPROM + EUI-48
- Project/Equipment
- Document
- Designer
- Drawn by
- Check.by
- Copyright WUT ISE 2020.
  This documentation describes Open Hardware and is licensed under the CERN OHL v.1.2. You may redistribute and modify this documentation under the terms of the CERN OHL v.1.2. (http://ohwr.org/CERNOHL). This documentation is distributed WITHOUT ANY EXPRESS OR IMPLIED WARRANTY, INCLUDING OF MERCHANTABILITY, SATISFACTORY QUALITY AND FITNESS FOR A PARTICULAR PURPOSE. Please see the CERN OHL v.1.2 for applicable conditions.
- Contact
- File
- Last Mod.
- Print Date
- Sheet
- Size
- A3
- of
- Rev
- (in symbol R0402_100R_1%_0.0625W_100PPM) 1%

### Library data of the parts
C38 C84 C86-C89 = CC0402_100NF_16V_10%_X5R: as C10 on sheet Magneto; Part Number: CC0402_100NF_16V_10%_X5R; Component Kind: Standard; Component Type: Standard; Pin Count: 2; Value: 100nF; Status: None; Manufacturer Part Number: CC0402_100NF_16V_10%_X5R; Case: 0402; Mounted: Yes; Socket: No; SMD: Yes; Sense: No; Manufacturer1 Example: MURATA; Manufacturer1 ComponentHeight: 0.55mm; HelpURL: \\cern.ch\dfs\Applications\Altium\Datasheets\CC0402_X5R_MURATA_GRM.pdf; Author: CERN DEM JLC; CreateDate: 10.12.2013; LatestRevisionDate: 10.12.2013
D2 = D_TVS_DRTR5V0U4S-7: Integrated Quad Ultra-Low Capacitance ESD Protection; Part Description: Integrated Quad Ultra-Low Capacitance ESD (±8kV) Protection; Manufacturer1: DIODES; PressFit: No; Bonding: No; Status Comment: Active; Part Number: DRTR5V0U4S-7; Component Kind: Standard; Component Type: Standard; Device: DRTR5V0U4S-7; PackageDescription: SOT363, SC70-6, 0.65mm Pitch; 6 Pin, 1.25mm W X 2.00mm L X 1.10mm H body, IPC Medium Density; Status: Active; Manufacturer1 Part Number: DRTR5V0U4S-7; Pin Count: 6; Case: SOT363; Mounted: Yes; Socket: No; SMD: Yes; Sense: No; ComponentHeight: 1.1mm; HelpURL: \\cern.ch\dfs\Applications\Altium\Datasheets\PRTR5V0U4Y.pdf; Author: GK; CreateDate: 24.01.2017; LatestRevisionDate: 14.09.2020
IC4 IC5 IC34 = IFC_FIN1028: 3.3V LVDS 2-Bit High-Speed Differential Reciever; Manufacturer1: ON Semiconductor; PressFit: No; Bonding: No; Part Number: FIN1028MX; Component Kind: Standard; Component Type: Standard; Device: FIN1028MX; PackageDescription: SOIC 8, Pitch 1.27mm - Body 4x5mm, IPC Medium Density; Part Description: 3.3V LVDS 2-Bit High-Speed Differential Reciever; Manufacturer1 Part Number: FIN1028MX; Pin Count: 8; Case: SOIC8; Mounted: Yes; Socket: No; SMD: Yes; Sense: No; ComponentHeight: 0.8mm; Author: GK; HelpURL: \\cern.ch\dfs\Applications\Altium\Datasheets\FIN1101K8X.pdf; CreateDate: 08/11/2016; LatestRevisionDate: 08/11/2016
IC6 = 24AA02E48T-I/OT: 1.7V-5.5V, 2K I2C Serial EEPROM With EUI-48 Node Identity; Manufacturer: MICROCHIP TECHNOLOGY; PressFit: No; Bonding: No; Part Number: 24AA02E48T-I/OT; Component Kind: Standard; Component Type: Standard; Device: 24AA02E48T-I/OT; PackageDescription: SOT, 0.95mm pitch; 5 pin, 1.60mm W X 2.90mm L X 1.45mm H body, IPC Medium Density; Part Description: 1.7V-5.5V, 2K I2C Serial EEPROM With EUI-48 Node Identity; Manufacturer Part Number: 24AA02E48T-I/OT; Pin Count: 5; Case: SOT23-5; Mounted: Yes; Socket: No; SMD: Yes; Sense: No; ComponentHeight: 1.45mm; HelpURL: \\cern.ch\dfs\Applications\Altium\Datasheets\24AA02E48T-I-OT.pdf; Author: CERN DEM MR; CreateDate: 31.03.2016; LatestRevisionDate: 31.03.2016
IC7 = IFC_FIN1027A: 3.3V LVDS, 2-Bit, High-Speed, Differential Driver; Manufacturer1: ON Semiconductor; PressFit: No; Bonding: No; Part Number: FIN1027AMX; Component Kind: Standard; Component Type: Standard; Device: FIN1027AMX; PackageDescription: SOIC 8, Pitch 1.27mm - Body 4x5mm, IPC Medium Density; Part Description: 3.3V LVDS, 2-Bit, High-Speed, Differential Driver; Manufacturer1 Part Number: FIN1027AMX; Pin Count: 8; Case: SOIC8; Mounted: Yes; Socket: No; SMD: Yes; Sense: No; ComponentHeight: 0.8mm; Author: GK; HelpURL: \\cern.ch\dfs\Applications\Altium\Datasheets\FIN1101K8X.pdf; CreateDate: 08/11/2016; LatestRevisionDate: 08/11/2016
IC10 = 24AA025E48-I/SN: 1.7V-5.5V, 2K I2C™ Serial EEPROMs with EUI-48™ Node Identity; Manufacturer1: MICROCHIP TECHNOLOGY; PressFit: No; Bonding: No; Part Number: 24AA02E48T-I/SN; Component Kind: Standard; Component Type: Standard; Device: 24AA02E48T-I/SN; PackageDescription: SOIC 8, Pitch 1.27mm - Body 4x5mm, IPC Medium Density; Part Description: 1.7V-5.5V, 2K I2C™ Serial EEPROMs with EUI-48™ Node Identity; Manufacturer1 Part Number: 24AA02E48T-I/SN; Pin Count: 8; Case: SOIC8; Mounted: Yes; Socket: No; SMD: Yes; Sense: No; ComponentHeight: 1.75mm; HelpURL: \\cern.ch\dfs\Applications\Altium\Datasheets\24AA025E48-I-SN.pdf; Author: CERN DEM MR; CreateDate: 19.07.2016; LatestRevisionDate: 19.07.2016
J2 = 3M_N2530-6002RB: Connector 30 Male; Part Description: 30 Contacts - Straight .100'' x .100'' Low Profile Four-Wall Header, 2500 Series; Manufacturer: 3M; PressFit: No; Part Number: 3M_N2530-6002RB; Component Kind: Standard; Component Type: Standard; Pin Count: 30; Family: Header 30; Mounted: Yes; Socket: No; SMD: No; Sense: No; Status: None; Manufacturer Part Number: N2530-6002RB; ComponentHeight: 10.03mm; HelpURL: \\cern.ch\dfs\Applications\Altium\Datasheets\3M_N2530-6002RB.pdf; Author: CERN DEM JLC; CreateDate: 11.02.2009; LatestRevisionDate: 11.08.2009
R3 R8 R10 R12-R18 R158 R161 R162 = R0402_100R_1%_0.0625W_100PPM: Resistor - 1%; Part Description: General Purpose Thick Film Chip Resistor; Manufacturer: GENERIC; Manufacturer1: Vishay; Manufacturer1 Part Number: RCA0402100RFKED; TC: ±100ppm/°C; PressFit: No; Part Number: R0402_100R_1%_0.0625W_100PPM; Component Kind: Standard; Component Type: Standard; Pin Count: 2; Value: 100; Status: Not Recommended; Power: 0.0625W; Tolerance: ±1%; Manufacturer Part Number: R0402_100R_1%_0.0625W_100PPM; Case: 0402; Mounted: Yes; Sense: No; Socket: No; SMD: Yes; Manufacturer1 ComponentHeight: 0.4mm; HelpURL: \\cern.ch\dfs\Applications\Altium\Datasheets\R0402_Phycomp_RC0402.pdf; Author: CERN DEM JLC; CreateDate: 03.12.2007; LatestRevisionDate: 17.10.2012
R31 R34-R38 R44-R46 R59-R63 R66 R67 R150 R151 = R0402_0R_JUMPER: Resistor; Part Description: 1A (0.05R Max DC Resistance) Zero Ohm Jumper; Manufacturer: GENERIC; Manufacturer1: Vishay; Manufacturer1 Part Number: CRCW04020000Z0EDC; PressFit: No; Part Number: R0402_0R_JUMPER; Component Kind: Standard; Component Type: Standard; Pin Count: 2; Value: 0; Status: Not Recommended; Manufacturer Part Number: R0402_0R_JUMPER; Case: 0402; Mounted: Yes; Sense: No; Socket: No; SMD: Yes; Manufacturer1 ComponentHeight: 0.4mm; HelpURL: \\cern.ch\dfs\Applications\Altium\Datasheets\R0402_Phycomp_RC0402.pdf; Author: CERN DEM JLC; CreateDate: 03.12.2007; LatestRevisionDate: 17.10.2012
R149 = R0805_0R_JUMPER: as R129 on sheet Magneto; Part Number: R0805_0R_JUMPER; Component Kind: Standard; Component Type: Standard; Pin Count: 2; Value: 0; Status: Preferred; Manufacturer Part Number: R0805_0R_JUMPER; Case: 0805; Mounted: Yes; Sense: No; Socket: No; SMD: Yes; Manufacturer1 ComponentHeight: 0.6mm; HelpURL: \\cern.ch\dfs\Applications\Altium\Datasheets\R0805_NIC_NRC.pdf; Author: CERN DEM JLC; CreateDate: 03.12.2007; LatestRevisionDate: 13.03.2008
R152 R153 = R0402_10K_1%_0.0625W_100PPM: as R2 on sheet Magneto; Part Number: R0402_10K_1%_0.0625W_100PPM; Component Kind: Standard; Component Type: Standard; Pin Count: 2; Value: 10k; Status: Not Recommended; Power: 0.0625W; Manufacturer Part Number: R0402_10K_1%_0.0625W_100PPM; Case: 0402; Mounted: Yes; Sense: No; Socket: No; SMD: Yes; Manufacturer1 ComponentHeight: 0.4mm; HelpURL: \\cern.ch\dfs\Applications\Altium\Datasheets\R0402_Phycomp_RC0402.pdf; Author: CERN DEM JLC; CreateDate: 03.12.2007; LatestRevisionDate: 17.10.2012
TP5-TP7 = SMD_PAD_1.27X1.27MM: Part Description: 1.27mm x 1.27mm PCB Copper Area (SMD Test Point); Mounted: No; Part Number: SMD_PAD_1.27X1.27MM; Component Type: Standard (No BOM); Pin Count: 1; Family: Test Point; Socket: No; SMD: Yes; Sense: No; Status: None; ComponentHeight: 0mm; HelpURL: Undefined; Author: CERN DEM JLC; CreateDate: 12.01.2008; LatestRevisionDate: 12.01.2008; PackageDescription: 1.27mm x 1.27mm PCB Copper Area (SMD Test Point)

## Sheet DIOT_Connectors_Magneto.SchDoc: DIOT
size 420 x 297 mm; Project: HVPSU_ISOL.PrjPCB; Author: G.Kasprowicz; CompanyName: WUT ISE; DrawnBy: G.Kasprowicz; Organization: WUT ISE; Address1: PW ISE; Address2: Nowowiejska 15/19 00-665 Warsaw; Address3: gkasprow@gmail.com; DocumentNumber: 2; Revision: 2; SheetNumber: 2; SheetTotal: 7; ModifiedBy: -; CheckedDate: -; Title2: Connector; DivGrp: WUT ISE; Designer: G.Kasprowicz; ModifiedDate: -; ProjectName: Sensor Box
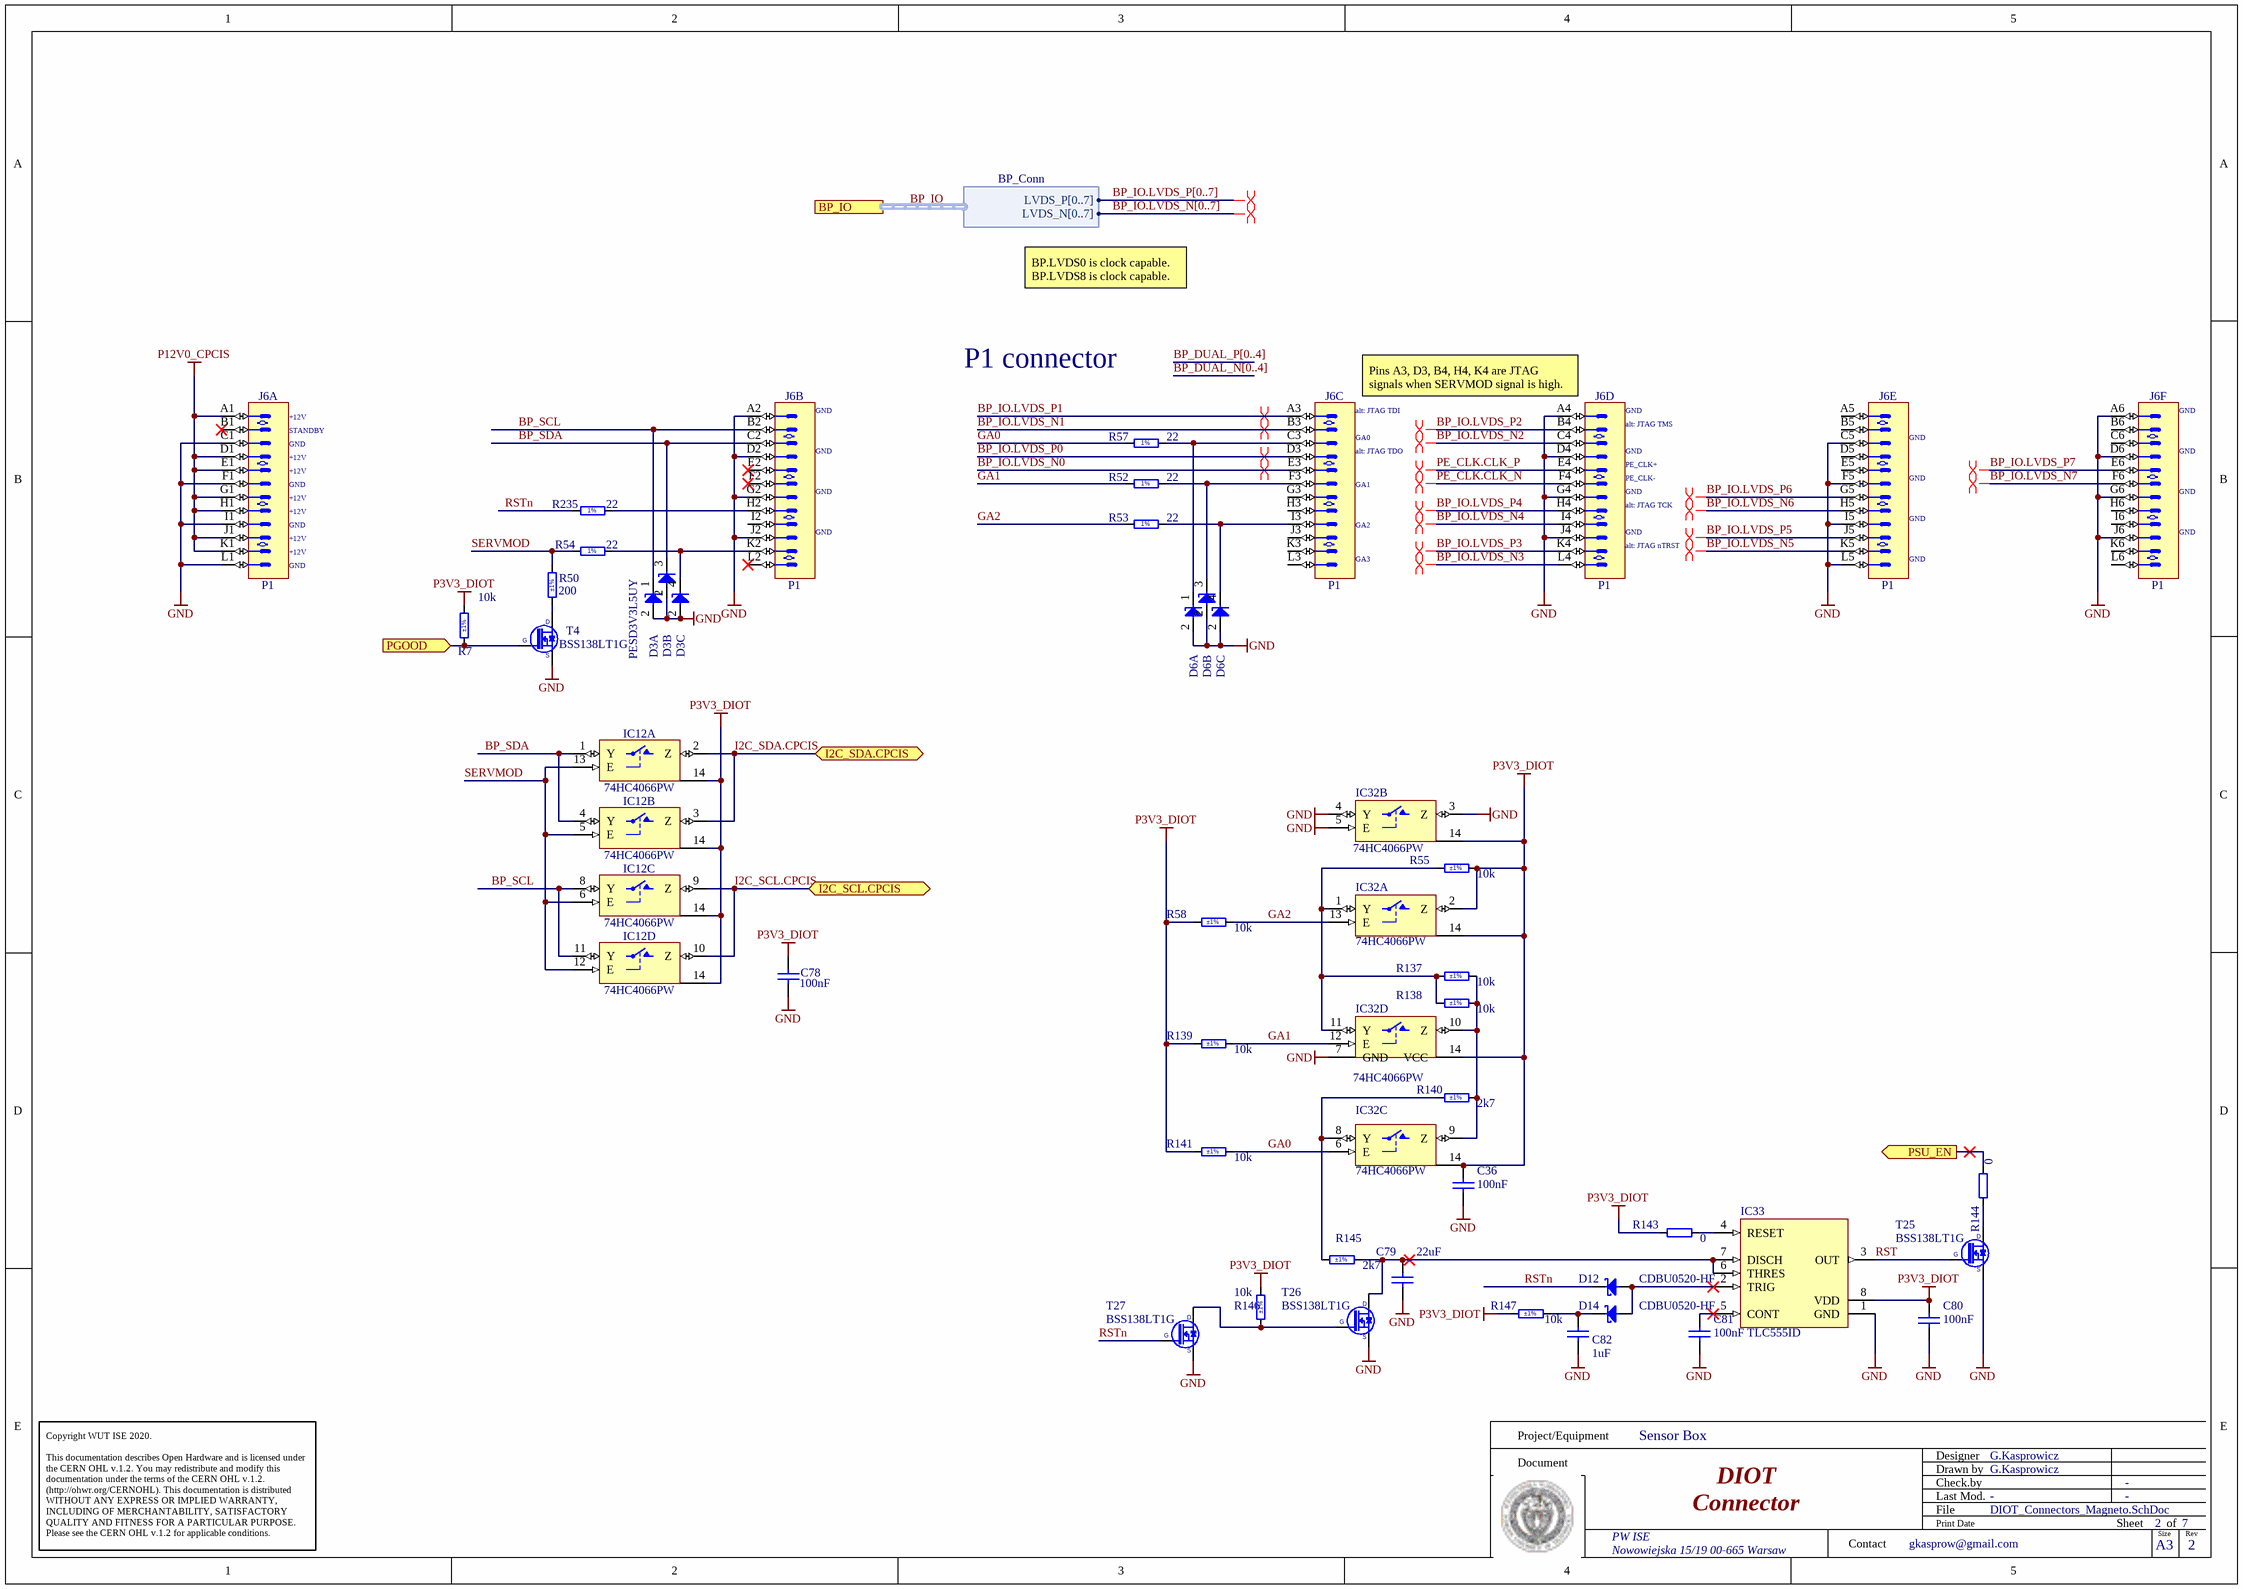
[diagram p2: DIOT_Connectors_Magneto.SchDoc]

### Parts
C36  100nF  [CAPC1608X87N]
C78  100nF  [CAPC1005X55N]
C79  22uF  [CAPC2012X135N]
C80  100nF  [CAPC1608X87N]
C81  100nF  [CAPC1608X87N]
C82  1uF  [CAPC1608X87N]
D3  PESD3V3L5UY  [SOT65P210X110-6N]  (value not drawn)  (parts A,B,C of 5)
D6  PESD3V3L5UY  [SOT65P210X110-6N]  (value not drawn)  (parts A,B,C of 5)
D12  CDBU0520-HF  [SOD-523F]
D14  CDBU0520-HF  [SOD-523F]
IC12  74HC4066PW  [SOP65P640X110-14N]  (parts A,B,C,D of 4)
IC32  74HC4066PW  [SOP65P640X110-14N]  (parts A,B,C,D of 4)
IC33  TLC555ID  [SOIC127P600X175-8N]
J6  P1  [AMPHENOL_10052825-101LF]  (parts A,B,C,D,E,F of 6)
R7  10k  Tolerance: ±1%  [RESC1608X55N]
R50  200  Tolerance: ±1%  [RESC1608X55N]
R52  22  [RESC1005X40N]
R53  22  [RESC1005X40N]
R54  22  [RESC1005X40N]
R55  10k  Tolerance: ±1%  [RESC1608X55N]
R57  22  [RESC1005X40N]
R58  10k  Tolerance: ±1%  [RESC1608X55N]
R137  10k  Tolerance: ±1%  [RESC1608X55N]
R138  10k  Tolerance: ±1%  [RESC1608X55N]
R139  10k  Tolerance: ±1%  [RESC1608X55N]
R140  2k7  Tolerance: ±1%  [RESC1608X55N]
R141  10k  Tolerance: ±1%  [RESC1608X55N]
R143  0  [RESC1608X55N]
R144  0  [RESC1608X55N]
R145  2k7  Tolerance: ±1%  [RESC1608X55N]
R146  10k  Tolerance: ±1%  [RESC1608X55N]
R147  10k  Tolerance: ±1%  [RESC1608X55N]
R235  22  [RESC1005X40N]
T4  BSS138LT1G  [SOT95P240X110-3N]
T25  BSS138LT1G  [SOT95P240X110-3N]
T26  BSS138LT1G  [SOT95P240X110-3N]
T27  BSS138LT1G  [SOT95P240X110-3N]

### Ports
BP_IO (harness BP_Conn), I2C_SCL.CPCIS (bidir), I2C_SDA.CPCIS (bidir), PGOOD (in), PSU_EN (out)

### Harnesses
BP_Conn: LVDS_P[0..7], LVDS_N[0..7]

### Nets
GND: C36.1 C78.1 C79.1 C80.1 C81.1 C82.1 D3.2(A) D6.2(A) IC12.7(GND) IC32.3(Z) IC32.4(Y) IC32.5(E) IC32.7(GND) IC33.1(GND) J6.A2 J6.A4 J6.A6 J6.C1 J6.C5 J6.D2 J6.D4 J6.D6 J6.F1 J6.F5 J6.G2 J6.G4 J6.G6 J6.I1 J6.I5 J6.J2 J6.J4 J6.J6 J6.L1 J6.L5 T4.2(S) T25.2(S) T26.2(S) T27.2(S)
P3V3_DIOT: C36.2 C78.2 C80.2 IC12.14(VCC) IC32.2(Z) IC32.14(VCC) IC33.8(VDD) R7.2 R55.2 R58.1 R139.1 R141.1 R143.1 R146.2 R147.1
P12V0_CPCIS: J6.A1 J6.D1 J6.E1 J6.G1 J6.H1 J6.J1 J6.K1
BP_IO.LVDS_N0: J6.E3
BP_IO.LVDS_N1: J6.B3
BP_IO.LVDS_N2: J6.C4
BP_IO.LVDS_N3: J6.L4
BP_IO.LVDS_N4: J6.I4
BP_IO.LVDS_N5: J6.K5
BP_IO.LVDS_N6: J6.H5
BP_IO.LVDS_N7: J6.F6
BP_IO.LVDS_P0: J6.D3
BP_IO.LVDS_P1: J6.A3
BP_IO.LVDS_P2: J6.B4
BP_IO.LVDS_P3: J6.K4
BP_IO.LVDS_P4: J6.H4
BP_IO.LVDS_P5: J6.J5
BP_IO.LVDS_P6: J6.G5
BP_IO.LVDS_P7: J6.E6
BP_SCL: D3.1(C) IC12.8(Y) IC12.11(Y) J6.B2
BP_SDA: D3.3(C) IC12.1(Y) IC12.4(Y) J6.C2
GA0: IC32.6(E) R57.1 R141.2
GA1: IC32.12(E) R52.1 R139.2
GA2: IC32.13(E) R53.1 R58.2
I2C_SCL.CPCIS: IC12.9(Z) IC12.10(Z) ; port I2C_SCL.CPCIS
I2C_SDA.CPCIS: IC12.2(Z) IC12.3(Z) ; port I2C_SDA.CPCIS
PE_CLK.CLK_N: J6.F4
PE_CLK.CLK_P: J6.E4
PGOOD: R7.1 T4.1(G) ; port PGOOD
PSU_EN: R144.2 ; port PSU_EN
RST: IC33.3(OUT) T25.1(G)
RSTn: D12.1(C) R235.1 T27.1(G)
SERVMOD: IC12.5(E) IC12.6(E) IC12.12(E) IC12.13(E) R50.2 R54.1
NetC79_2: C79.2 IC33.6(THRES) IC33.7(DISCH) R145.2 T26.3(D)
NetC81_2: C81.2 IC33.5(CONT)
NetC82_2: C82.2 D14.1(C) R147.2
NetD3_4: D3.4(C) J6.K2 R54.2
NetD6_1: D6.1(C) J6.C3 R57.2
NetD6_3: D6.3(C) J6.F3 R52.2
NetD6_4: D6.4(C) J6.I3 R53.2
NetD12_2: D12.2(A) D14.2(A) IC33.2(TRIG)
NetIC32_1: IC32.1(Y) IC32.11(Y) R55.1 R137.1 R138.1
NetIC32_8: IC32.8(Y) R140.1 R145.1
NetIC32_9: IC32.9(Z) IC32.10(Z) R137.2 R138.2 R140.2
NetIC33_4: IC33.4(RESET) R143.2
NetJ6_H2: J6.H2 R235.2
NetR50_1: R50.1 T4.3(D)
NetR144_1: R144.1 T25.3(D)
NetR146_1: R146.1 T26.1(G) T27.3(D)

Not connected (* = marked no-connect by the designer): J6 A5 B1* B5 B6 C6 D5 E2* E5 F2* G3 H3 H6 I2 I6 J3 K3 K6 L2* L3 L6

### Buses and harness runs
bus BP_DUAL_N[0..4]
bus BP_DUAL_P[0..4]
bus BP_IO.LVDS_N[0..7]
bus BP_IO.LVDS_P[0..7]
harness BP_IO = port BP_IO

### Layout directives
differential pair: (no net found under the mark), BP_IO.LVDS_N0, BP_IO.LVDS_N1, BP_IO.LVDS_N2, BP_IO.LVDS_N3, BP_IO.LVDS_N4, BP_IO.LVDS_N5, BP_IO.LVDS_N6, BP_IO.LVDS_N7, BP_IO.LVDS_P0, BP_IO.LVDS_P1, BP_IO.LVDS_P2, BP_IO.LVDS_P3, BP_IO.LVDS_P4, BP_IO.LVDS_P5, BP_IO.LVDS_P6, BP_IO.LVDS_P7, PE_CLK.CLK_N, PE_CLK.CLK_P

### Notes on the sheet
- BP.LVDS0 is clock capable.
  BP.LVDS8 is clock capable.
- P1 connector
- (near J6) Pins A3, D3, B4, H4, K4 are JTAG signals when SERVMOD signal is high.
- (near J6) +12V
- (near J6) STANDBY
- (near J6) GND
- (near J6) alt: JTAG TDI
- (near J6) alt: JTAG TDO
- (near J6) GA0
- (near J6) alt: JTAG TMS
- (near J6) GA2
- (near J6) GA1
- (near J6) alt: JTAG TCK
- (near J6) PE_CLK+
- (near J6) PE_CLK-
- (near J6) GA3
- (near J6) alt: JTAG nTRST
- Project/Equipment
- Document
- Designer
- Drawn by
- Check.by
- Copyright WUT ISE 2020.
  This documentation describes Open Hardware and is licensed under the CERN OHL v.1.2. You may redistribute and modify this documentation under the terms of the CERN OHL v.1.2. (http://ohwr.org/CERNOHL). This documentation is distributed WITHOUT ANY EXPRESS OR IMPLIED WARRANTY, INCLUDING OF MERCHANTABILITY, SATISFACTORY QUALITY AND FITNESS FOR A PARTICULAR PURPOSE. Please see the CERN OHL v.1.2 for applicable conditions.
- Contact
- File
- Last Mod.
- Print Date
- Sheet
- Size
- A3
- of
- Rev
- (in symbol R0402_22R_1%_0.0625W_100PPM) 1%

### Library data of the parts
C36 C80 C81 = CC0603_100NF_50V_10%_X7R: Non-polarised capacitor; Part Description: SMD Multilayer Chip Ceramic Capacitor; Manufacturer: GENERIC; Manufacturer1 Part Number: 223858615649; Voltage: 50V; TC: X7R; Tolerance: ±10%; Part Number: CC0603_100NF_50V_10%_X7R; Component Kind: Standard; Component Type: Standard; Pin Count: 2; Value: 100nF; Status: Preferred; Manufacturer Part Number: CC0603_100NF_50V_10%_X7R; Case: 0603; Mounted: Yes; Socket: No; SMD: Yes; Sense: No; Manufacturer1 Example: PHYCOMP; Manufacturer1 ComponentHeight: 0.87mm; HelpURL: \\cern.ch\dfs\Applications\Altium\Datasheets\CC0603_X7R_PHYCOMP.pdf; Author: CERN DEM JLC; CreateDate: 03.12.2007; LatestRevisionDate: 03.12.2007
C78 = CC0402_100NF_16V_10%_X5R: as C10 on sheet Magneto; Part Number: CC0402_100NF_16V_10%_X5R; Component Kind: Standard; Component Type: Standard; Pin Count: 2; Value: 100nF; Status: None; Manufacturer Part Number: CC0402_100NF_16V_10%_X5R; Case: 0402; Mounted: Yes; Socket: No; SMD: Yes; Sense: No; Manufacturer1 Example: MURATA; Manufacturer1 ComponentHeight: 0.55mm; HelpURL: \\cern.ch\dfs\Applications\Altium\Datasheets\CC0402_X5R_MURATA_GRM.pdf; Author: CERN DEM JLC; CreateDate: 10.12.2013; LatestRevisionDate: 10.12.2013
C79 = CC0805_22UF_16V_10%_X5R: Non-polarised capacitor; Part Description: SMD Multilayer Chip Ceramic Capacitor; Manufacturer: GENERIC; Manufacturer1 Part Number: C2012X5R1C226KT; Voltage: 16V; TC: X5R; Tolerance: ±10%; Part Number: CC0805_22UF_16V_10%_X5R; Component Kind: Standard; Component Type: Standard; Pin Count: 2; Value: 22uF; Status: Preferred; Manufacturer Part Number: CC0805_22UF_16V_10%_X5R; Case: 0805; Mounted: Yes; Socket: No; SMD: Yes; Sense: No; Manufacturer1 Example: TDK; Manufacturer1 ComponentHeight: 1.35mm; HelpURL: \\cern.ch\dfs\Applications\Altium\Datasheets\CC0805_X5R_TDK_C.pdf; Author: CERN DEM JLC; CreateDate: 25.10.2012; LatestRevisionDate: 25.10.2012
C82 = CC0603_1UF_16V_10%_X7R: Non-polarised capacitor; Part Description: SMD Multilayer Chip Ceramic Capacitor; Manufacturer: GENERIC; Manufacturer1 Part Number: 223878615663; Voltage: 16V; TC: X7R; Tolerance: ±10%; Part Number: CC0603_1UF_16V_10%_X7R; Component Kind: Standard; Component Type: Standard; Pin Count: 2; Value: 1uF; Status: None; Manufacturer Part Number: CC0603_1UF_16V_10%_X7R; Case: 0603; Mounted: Yes; Socket: No; SMD: Yes; Sense: No; Manufacturer1 Example: YAGEO PHYCOMP; Manufacturer1 ComponentHeight: 0.9mm; HelpURL: \\cern.ch\dfs\Applications\Altium\Datasheets\CC0603_X7R_PHYCOMP.pdf; Author: CERN DEM JLC; CreateDate: 03.12.2007; LatestRevisionDate: 17.04.2015
D3 D6 = PESD3V3L5UY: Fivefold ESD Protection Diode Arrays; Part Description: Fivefold ESD Protection Diode Arrays (30kV); Manufacturer1: NEXPERIA; Manufacturer1 Part Number: PESD3V3L5UY,115; Voltage: 3.3V; Power: 200W; PressFit: No; Bonding: No; Part Number: PESD3V3L5UY; Component Kind: Standard; Component Type: Standard; Device: PESD3V3L5UY; PackageDescription: SOT363, SC-88, 0.65mm Pitch; 6 Pin, 1.25mm W X 2.00mm L X 1.10mm H body, IPC Medium Density; Pin Count: 6; Case: SOT363; Mounted: Yes; Socket: No; SMD: Yes; Sense: No; ComponentHeight: 1.1mm; HelpURL: \\cern.ch\dfs\Applications\Altium\Datasheets\PESD3V3L5UY.pdf; Author: CERN DEM WB; CreateDate: 05.07.2021; LatestRevisionDate: 05.07.2021
D12 D14 = CDBU0520-HF: Schottky Diode; Part Description: 20V Surface mount Schottky Barrier Diode; Manufacturer: COMCHIP; Voltage: 20V; Power: 500mA; PressFit: No; Bonding: No; Part Number: CDBU0520-HF; Component Kind: Standard; Component Type: Standard; Device: CDBU0520-HF; PackageDescription: Small Outline Diode Flat Lead (SOD-523F), Body; 1.80mm L X 1mm W X 0.85mm H; Manufacturer Part Number: CDBU0520-HF; Pin Count: 2; Case: SOD-523F; Mounted: Yes; Socket: No; SMD: Yes; Sense: No; ComponentHeight: 1mm; HelpURL: \\cern.ch\dfs\Applications\Altium\Datasheets\CDBU0520-HF.pdf; Author: CERN DEM HF; CreateDate: 13.10.2023; LatestRevisionDate: 13.10.2023
IC12 = 74HC4066PW: Part Description: Quad Single-Pole Single-Throw Analog Switch; Manufacturer1: NXP SEMICONDUCTORS; Manufacturer1 Part Number: 74HC4066PW,118; PressFit: No; Bonding: No; Part Number: 74HC4066PW; Component Kind: Standard; Component Type: Standard; Device: 74HC4066PW; PackageDescription: SOP, 14-Leads, Body 4.4x5mm (max), Pitch 0.65mm, IPC Medium Density; Pin Count: 14; Case: TSSOP14; Mounted: Yes; Socket: No; SMD: Yes; Sense: No; ComponentHeight: 1.1mm; Author: CERN DEM JLC; HelpURL: \\cern.ch\dfs\Applications\Altium\Datasheets\74HC4066PW.pdf; CreateDate: 19.11.2014; LatestRevisionDate: 19.11.2014
IC32 = 74HC4066PW: Part Description: Quad Single-Pole Single-Throw Analog Switch; Manufacturer: NXP SEMICONDUCTORS; PressFit: No; Bonding: No; Table: Standard Logic; Part Number: 74HC4066PW; Component Kind: Standard; Component Type: Standard; Device: 74HC4066PW; PackageDescription: SOP, 14-Leads, Body 4.4x5mm (max), Pitch 0.65mm, IPC Medium Density; Manufacturer Part Number: 74HC4066PW; Pin Count: 14; Case: TSSOP14; Mounted: Yes; Socket: No; SMD: Yes; ComponentHeight: 1.1mm; Author: CERN DEM JLC; HelpURL: \\cern.ch\dfs\Applications\Altium\Datasheets\74HC4066PW.pdf; CreateDate: 2014-11-19; LatestRevisionDate: 2014-11-19
IC33 = TLC555ID: LinCMOS Timer; Manufacturer: TEXAS INSTRUMENTS; PressFit: No; Bonding: No; Part Number: TLC555ID; Component Kind: Standard; Component Type: Standard; Device: TLC555ID; PackageDescription: SOIC 8, Pitch 1.27mm, Body 4x5mm, IPC Medium Density; Part Description: LinCMOS Timer; Manufacturer Part Number: TLC555ID; Pin Count: 8; Case: SOIC8; Mounted: Yes; Socket: No; SMD: Yes; Sense: No; ComponentHeight: 1.75mm; Author: CERN DEM JMW; HelpURL: \\cern.ch\dfs\Applications\Altium\Datasheets\TLC555ID.pdf; CreateDate: 23.08.2016; LatestRevisionDate: 23.08.2016
J6 = AMPHENOL_10052825-101LF: 72 Contacts Header, 6 Columns, 4 Pairs per Column; Part Description: 72 Contacts, 2mm Pitch, 6 Columns, 4 Pairs per Column, 4 Walls, Right Angle Header; Part Number: AMPHENOL_10052825-101LF; Component Kind: Standard; Component Type: Standard; Pin Count: 72; Family: AirMax VS; Mounted: Yes; Socket: No; SMD: No; PressFit: Yes; Sense: No; Status: None; Manufacturer1: AMPHENOL; Manufacturer1 Part Number: 10052825-101LF; ComponentHeight: 15.35mm; HelpURL: \\cern.ch\dfs\Applications\Altium\Datasheets\AMPHENOL_10052825-101LF.pdf; ComponentLink1URL: \\cern.ch\dfs\Applications\Altium\Datasheets\AMPHENOL_10052825-101LF_Application.pdf; ComponentLink1Description: Application; Author: CERN DEM MR; CreateDate: 19/02/2018; LatestRevisionDate: 19/02/2018; Classname: Overlapping
R7 R55 R58 R137-R139 R141 R146 R147 = R0603_10K_1%_0.1W_100PPM: Resistor - 1%; Part Description: General Purpose Thick Film Chip Resistor; Manufacturer: GENERIC; Manufacturer1 Part Number: NRC06F1002TRF; Power: 0.1W; TC: ±100ppm/°C; PressFit: No; Part Number: R0603_10K_1%_0.1W_100PPM; Component Kind: Standard; Component Type: Standard; Pin Count: 2; Value: 10k; Status: Preferred; Manufacturer Part Number: R0603_10K_1%_0.1W_100PPM; Case: 0603; Mounted: Yes; Sense: No; Socket: No; SMD: Yes; Manufacturer1 Example: NIC COMPONENT; Manufacturer1 ComponentHeight: 0.55mm; HelpURL: \\cern.ch\dfs\Applications\Altium\Datasheets\R0603_NIC_NRC.pdf; Author: CERN DEM JLC; CreateDate: 03.12.2007; LatestRevisionDate: 13.03.2008
R50 = R0603_200R_1%_0.1W_100PPM: as R6 on sheet Magneto; Part Number: R0603_200R_1%_0.1W_100PPM; Component Kind: Standard; Component Type: Standard; Pin Count: 2; Value: 200; Status: Preferred; Manufacturer Part Number: R0603_200R_1%_0.1W_100PPM; Case: 0603; Mounted: Yes; Sense: No; Socket: No; SMD: Yes; Manufacturer1 ComponentHeight: 0.55mm; HelpURL: \\cern.ch\dfs\Applications\Altium\Datasheets\R0603_NIC_NRC.pdf; Author: CERN DEM JLC; CreateDate: 03.12.2007; LatestRevisionDate: 13.03.2008
R52-R54 R57 = R0402_22R_1%_0.0625W_100PPM: Resistor - 1%; Part Description: General Purpose Thick Film Chip Resistor; Manufacturer: GENERIC; Manufacturer1: Vishay; Manufacturer1 Part Number: CRCW040222R0FKEDC; TC: ±100ppm/°C; PressFit: No; Part Number: R0402_22R_1%_0.0625W_100PPM; Component Kind: Standard; Component Type: Standard; Pin Count: 2; Value: 22; Status: Not Recommended; Power: 0.0625W; Tolerance: ±1%; Manufacturer Part Number: R0402_22R_1%_0.0625W_100PPM; Case: 0402; Mounted: Yes; Socket: No; SMD: Yes; Manufacturer1 ComponentHeight: 0.4mm; HelpURL: \\cern.ch\dfs\Applications\Altium\Datasheets\R0402_Phycomp_RC0402.pdf; Author: CERN DEM JLC; CreateDate: 03.12.2007; LatestRevisionDate: 17.10.2012; Sense: No
R140 R145 = R0603_2K7_1%_0.1W_100PPM: Resistor - 1%; Part Description: General Purpose Thick Film Chip Resistor; Manufacturer: GENERIC; Manufacturer1 Part Number: RC0603FR-072K7L; Power: 0.1W; TC: ±100ppm/°C; PressFit: No; Part Number: R0603_2K7_1%_0.1W_100PPM; Component Kind: Standard; Component Type: Standard; Pin Count: 2; Value: 2k7; Status: Preferred; Manufacturer Part Number: R0603_2K7_1%_0.1W_100PPM; Case: 0603; Mounted: Yes; Sense: No; Socket: No; SMD: Yes; Manufacturer1 Example: YAGEO PHYCOMP; Manufacturer1 ComponentHeight: 0.55mm; HelpURL: \\cern.ch\dfs\Applications\Altium\Datasheets\R0603_PHYCOMP_RC0603.pdf; Author: CERN DEM JLC; CreateDate: 02.05.2011; LatestRevisionDate: 02.05.2011
R143 R144 = R0603_0R_JUMPER: Resistor; Part Description: 1A (0.05R Max DC Resistance) Zero Ohm Jumper; Manufacturer: GENERIC; Manufacturer1 Part Number: NRC06Z0; PressFit: No; Part Number: R0603_0R_JUMPER; Component Kind: Standard; Component Type: Standard; Pin Count: 2; Value: 0; Status: Preferred; Manufacturer Part Number: R0603_0R_JUMPER; Case: 0603; Mounted: Yes; Sense: No; Socket: No; SMD: Yes; Manufacturer1 Example: NIC COMPONENT; Manufacturer1 ComponentHeight: 0.55mm; HelpURL: \\cern.ch\dfs\Applications\Altium\Datasheets\R0603_NIC_NRC.pdf; Author: CERN DEM JLC; CreateDate: 03.12.2007; LatestRevisionDate: 13.03.2008
R235 = R0402_22R_1%_0.0625W_100PPM: Resistor - 1%; Part Description: General Purpose Thick Film Chip Resistor; Manufacturer: GENERIC; Manufacturer1: Vishay; Manufacturer1 Part Number: CRCW040222R0FKEDC; PressFit: No; Part Number: R0402_22R_1%_0.0625W_100PPM; Component Kind: Standard; Component Type: Standard; Pin Count: 2; Value: 22; Status: Not Recommended; Power: 0.0625W; Tolerance: ±1%; Manufacturer Part Number: R0402_22R_1%_0.0625W_100PPM; Case: 0402; Mounted: Yes; Socket: No; SMD: Yes; Manufacturer1 ComponentHeight: 0.4mm; HelpURL: \\cern.ch\dfs\Applications\Altium\Datasheets\R0402_Phycomp_RC0402.pdf; Author: CERN DEM JLC; CreateDate: 03.12.2007; LatestRevisionDate: 17.10.2012; Sense: No
T4 T25-T27 = BSS138LT1G: N-CHANNEL MOSFET WITH DIODE; Part Description: 50V, 200mA N-Channel Enhancement Mode Field-Effect Transistor; Manufacturer: ON SEMICONDUCTOR; PressFit: No; Bonding: No; Part Number: BSS138LT1G; Component Kind: Standard; Component Type: Standard; Device: BSS138LT1G; PackageDescription: SOT23, 0.95mm Pitch; 3 Pin, 1.40mm W X 3.00mm L X 1.10mm H body, IPC Medium Density; Manufacturer Part Number: BSS138L; Pin Count: 3; Case: SOT23-3; Mounted: Yes; Socket: No; SMD: Yes; Sense: No; ComponentHeight: 1.11mm; HelpURL: \\cern.ch\dfs\Applications\Altium\Datasheets\BSS138LT1G.pdf; Author: CERN DEM JLC; CreateDate: 23.03.2009; LatestRevisionDate: 25.05.2022